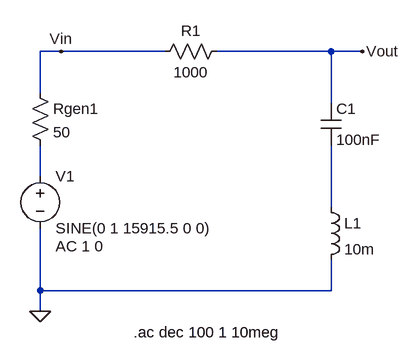
[diagram p0: schematic RLC_bandreject_filter.asc]
RLC_bandreject_filter.asc, the LTspice schematic file:
Version 4
SHEET 1 880 680
WIRE 16 -48 -16 -48
WIRE 176 -48 16 -48
WIRE 432 -48 256 -48
WIRE 480 -48 432 -48
WIRE -16 16 -16 -48
WIRE 432 32 432 -48
WIRE -16 144 -16 96
WIRE 432 192 432 96
WIRE -16 320 -16 224
WIRE 432 320 432 272
WIRE 432 320 -16 320
WIRE -16 352 -16 320
FLAG -16 352 0
FLAG 480 -48 Vout
FLAG 16 -48 Vin
SYMBOL voltage -16 128 R0
WINDOW 123 24 124 Left 2
WINDOW 39 0 0 Left 0
SYMATTR Value2 AC 1 0
SYMATTR InstName V1
SYMATTR Value SINE(0 1 15915.5 0 0)
SYMBOL res -32 0 R0
SYMATTR InstName Rgen1
SYMATTR Value 50
SYMBOL res 272 -64 R90
WINDOW 0 0 56 VBottom 2
WINDOW 3 32 56 VTop 2
SYMATTR InstName R1
SYMATTR Value 1000
SYMBOL ind 416 176 R0
SYMATTR InstName L1
SYMATTR Value 10m
SYMBOL cap 416 32 R0
SYMATTR InstName C1
SYMATTR Value 100nF
TEXT 128 384 Left 2 !.ac dec 100 1 10meg

The netlist it stands for:
* RLC_bandreject_filter.asc
V1 N001 0 SINE(0 1 15915.5 0 0) AC 1 0
Rgen1 Vin N001 50
R1 Vout Vin 1000
L1 N002 0 10m
C1 Vout N002 100nF
.ac dec 100 1 10meg
.backanno
.end